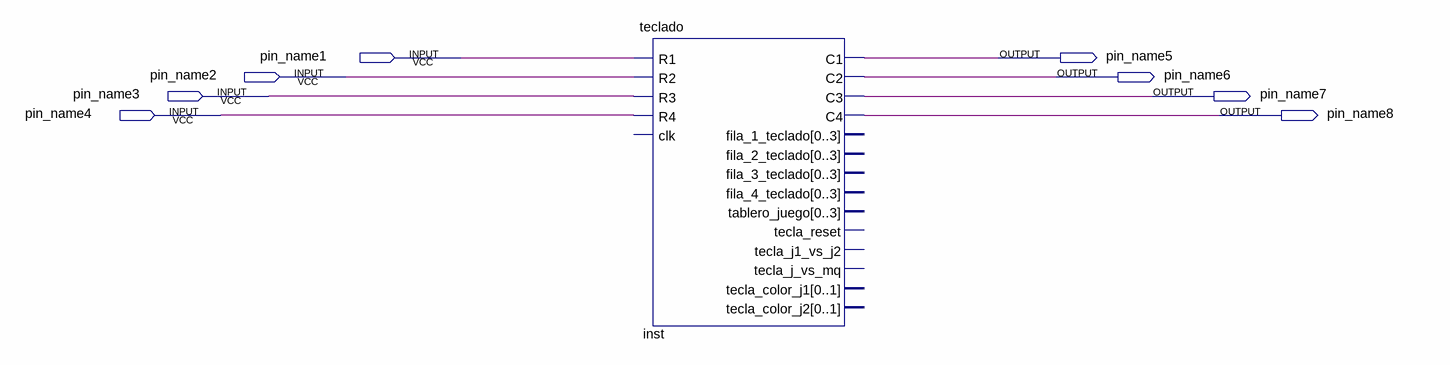
[diagram p0: schematic sheet]
// Quartus schematic bloque_teclado.bdf as structural Verilog: 1 symbols, 8 pins
module bloque_teclado (
  input  pin_name1,
  input  pin_name2,
  input  pin_name3,
  input  pin_name4,
  output pin_name5,
  output pin_name6,
  output pin_name7,
  output pin_name8
);

  teclado inst (
    .R1(pin_name1), .R2(pin_name2), .R3(pin_name3), .R4(pin_name4), .C1(pin_name5), .C2(pin_name6),
    .C3(pin_name7), .C4(pin_name8));  // open: clk, fila_1_teclado, fila_2_teclado, fila_3_teclado, fila_4_teclado, tablero_juego, tecla_reset, tecla_j1_vs_j2, tecla_j_vs_mq, tecla_color_j1, tecla_color_j2
endmodule
